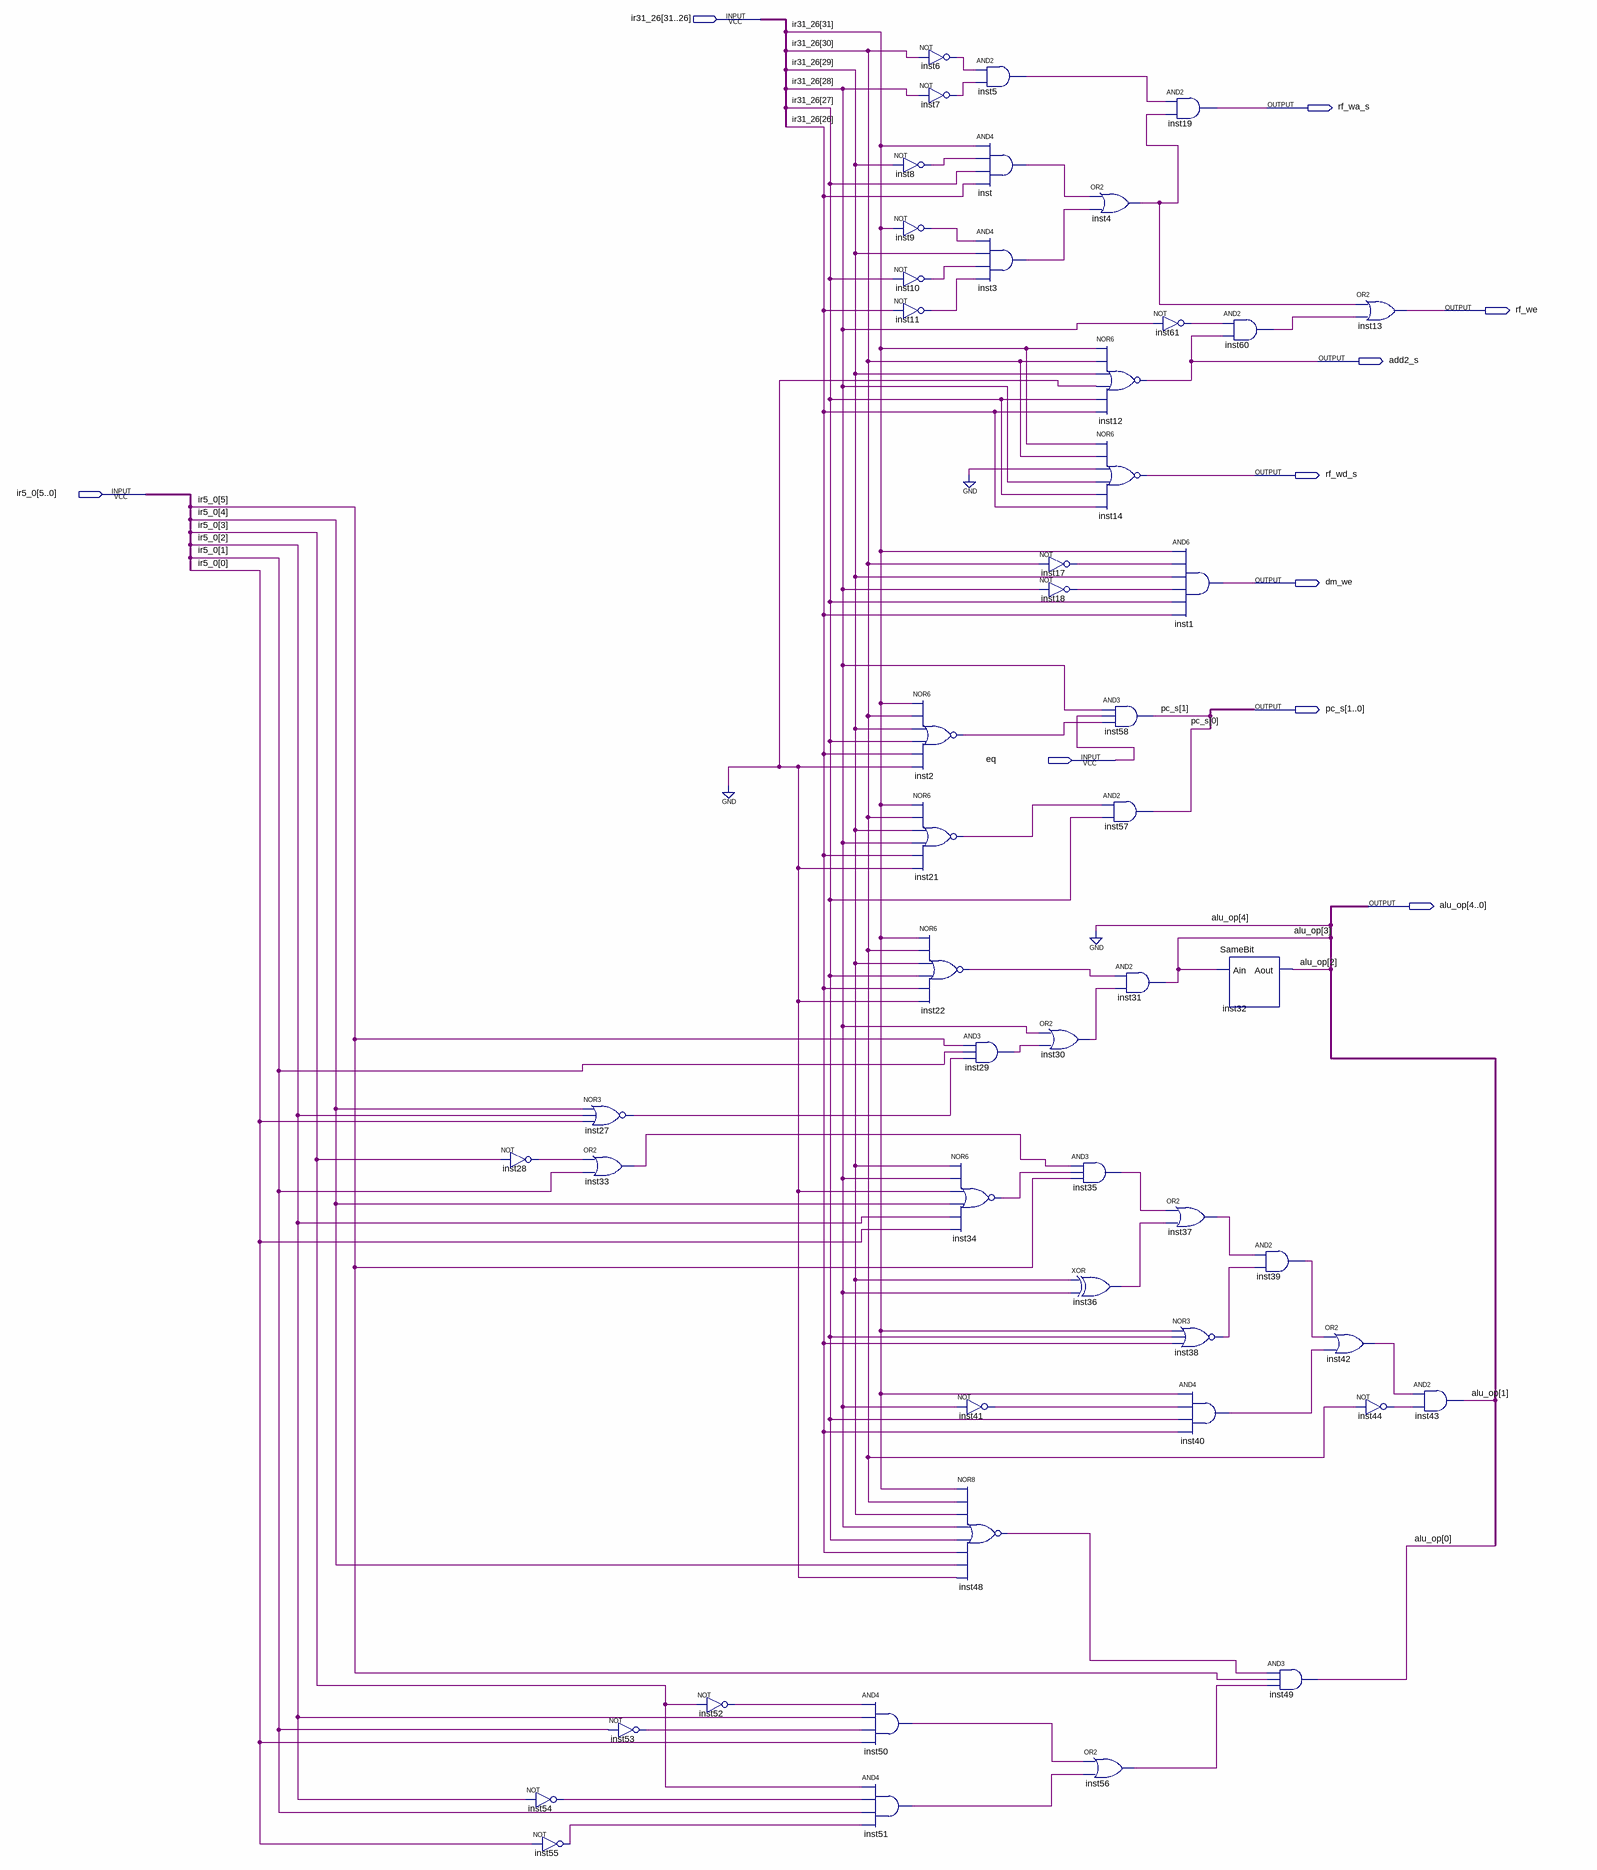
[diagram p0: schematic sheet]
// Quartus schematic CTRL.bdf as structural Verilog: 51 symbols, 10 pins
module CTRL (
  input  [31:26] ir31_26,
  input  [5:0] ir5_0,
  input  eq,
  output rf_wa_s,
  output rf_we,
  output add2_s,
  output rf_wd_s,
  output dm_we,
  output [1:0] pc_s,
  output [4:0] alu_op
);

  wire inst2_out, inst3_out, inst4_out, inst5_out, inst6_out, inst7_out, inst8_out, inst9_out, inst10_out,
       inst11_out, inst17_out, inst18_out, inst21_out, inst22_out, inst27_out, inst28_out, inst29_out,
       inst30_out, inst33_out, inst34_out, inst35_out, inst36_out, inst37_out, inst38_out, inst39_out,
       inst40_out, inst41_out, inst42_out, inst44_out, inst48_out, inst50_out, inst51_out, inst52_out,
       inst53_out, inst54_out, inst55_out, inst56_out, inst60_out, inst61_out, inst_out;

  not inst28 (inst28_out, ir5_0[3]);
  not inst54 (inst54_out, ir5_0[2]);
  not inst55 (inst55_out, ir5_0[0]);
  nor inst27 (inst27_out, ir5_0[4], ir5_0[2], ir5_0[0]);
  or inst33 (inst33_out, inst28_out, ir5_0[1]);
  not inst53 (inst53_out, ir5_0[1]);
  not inst52 (inst52_out, ir5_0[3]);
  and inst50 (inst50_out, inst52_out, ir5_0[2], inst53_out, ir5_0[0]);
  and inst51 (inst51_out, ir5_0[3], inst54_out, ir5_0[1], inst55_out);
  not inst6 (inst6_out, ir31_26[30]);
  not inst7 (inst7_out, ir31_26[28]);
  not inst8 (inst8_out, ir31_26[29]);
  not inst9 (inst9_out, ir31_26[31]);
  not inst10 (inst10_out, ir31_26[27]);
  not inst11 (inst11_out, ir31_26[26]);
  nor inst2 (inst2_out, ir31_26[31], ir31_26[30], ir31_26[29], ir31_26[27], ir31_26[26], 1'b0);
  nor inst21 (inst21_out, ir31_26[31], ir31_26[30], ir31_26[29], ir31_26[28], ir31_26[26], 1'b0);
  nor inst22 (inst22_out, ir31_26[31], ir31_26[30], ir31_26[29], ir31_26[27], ir31_26[26], 1'b0);
  and inst5 (inst5_out, inst6_out, inst7_out);
  and inst (inst_out, ir31_26[31], inst8_out, ir31_26[27], ir31_26[26]);
  and inst3 (inst3_out, inst9_out, ir31_26[29], inst10_out, inst11_out);
  and inst29 (inst29_out, ir5_0[5], ir5_0[1], inst27_out);
  nor inst34 (inst34_out, ir31_26[29], ir31_26[28], 1'b0, ir5_0[4], ir5_0[2], ir5_0[0]);
  not inst41 (inst41_out, ir31_26[28]);
  nor inst48 (inst48_out, ir31_26[31], ir31_26[30], ir31_26[29], ir31_26[28], ir31_26[27], ir31_26[26], ir5_0[4], 1'b0);
  not inst17 (inst17_out, ir31_26[30]);
  not inst18 (inst18_out, ir31_26[28]);
  or inst30 (inst30_out, ir31_26[28], inst29_out);
  and inst35 (inst35_out, inst33_out, inst34_out, ir5_0[5]);
  xor inst36 (inst36_out, ir31_26[29], ir31_26[28]);
  or inst56 (inst56_out, inst50_out, inst51_out);
  or inst4 (inst4_out, inst_out, inst3_out);
  nor inst12 (add2_s, ir31_26[31], ir31_26[30], ir31_26[29], 1'b0, ir31_26[27], ir31_26[26]);
  nor inst14 (rf_wd_s, ir31_26[31], ir31_26[30], 1'b0, ir31_26[28], ir31_26[27], ir31_26[26]);
  and inst58 (pc_s[1], ir31_26[28], eq, inst2_out);
  and inst57 (pc_s[0], inst21_out, ir31_26[27]);
  and inst31 (alu_op[3], inst22_out, inst30_out);
  and inst19 (rf_wa_s, inst5_out, inst4_out);
  not inst61 (inst61_out, ir31_26[28]);
  and inst1 (dm_we, ir31_26[31], inst17_out, ir31_26[29], inst18_out, ir31_26[27], ir31_26[26]);
  or inst37 (inst37_out, inst35_out, inst36_out);
  nor inst38 (inst38_out, ir31_26[31], ir31_26[27], ir31_26[26]);
  and inst40 (inst40_out, ir31_26[31], inst41_out, ir31_26[27], ir31_26[26]);
  and inst60 (inst60_out, inst61_out, add2_s);
  SameBit inst32 (.Ain(alu_op[3]), .Aout(alu_op[2]));
  and inst39 (inst39_out, inst37_out, inst38_out);
  and inst49 (alu_op[0], inst48_out, ir5_0[5], inst56_out);
  or inst42 (inst42_out, inst39_out, inst40_out);
  or inst13 (rf_we, inst4_out, inst60_out);
  not inst44 (inst44_out, ir31_26[30]);
  and inst43 (alu_op[1], inst42_out, inst44_out);

  assign alu_op[4] = 1'b0;
endmodule
